# Altium schematic sheet 18-GSM_GPRS (SIM808).SchDoc
size A4
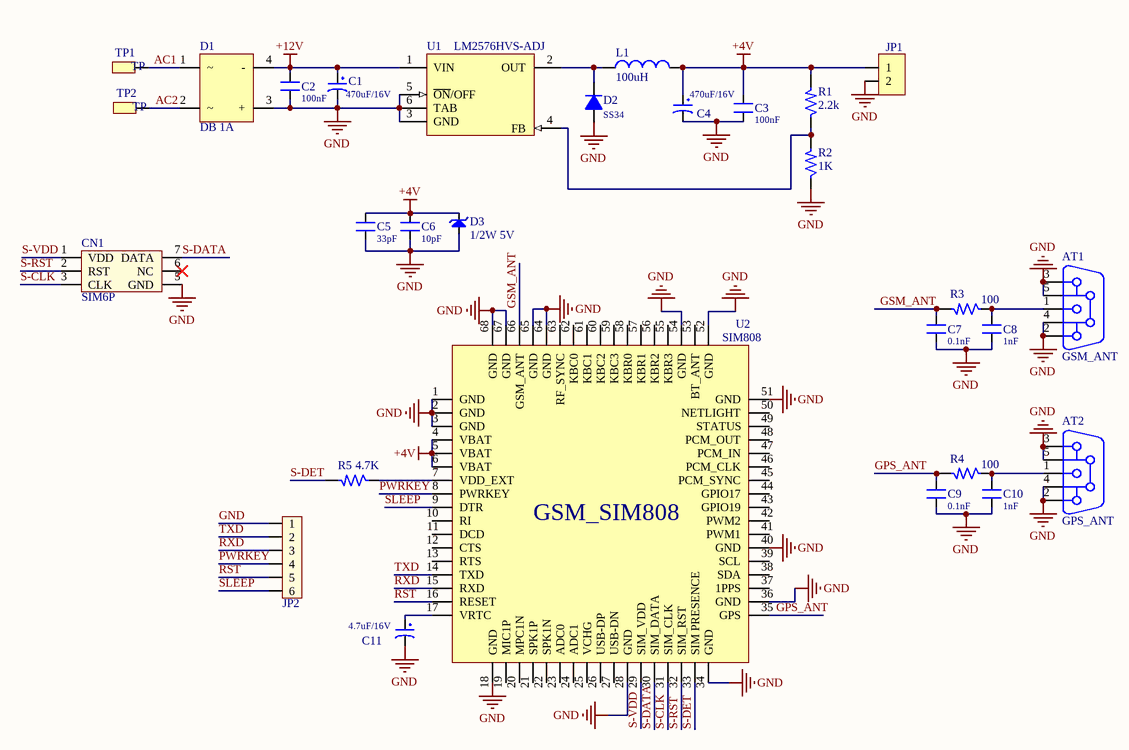
[diagram p0: 18-GSM_GPRS (SIM808).SchDoc]

## Parts
AT1  GSM_ANT  [SMA-RA]
AT2  GPS_ANT  [SMA-RA]
C1  470uF/16V  [C-TANT-7343]
C2  100nF  [CER-0805]
C3  100nF  [CER-0805]
C4  470uF/16V  [C-TANT-7343]
C5  33pF  [CER-0805]
C6  10pF  [CER-0805]
C7  0.1nF  [CER-0805]
C8  1nF  [CER-0805]
C9  0.1nF  [CER-0805]
C10  1nF  [CER-0805]
C11  4.7uF/16V  [C-TANT-7343]
CN1  SIM6P  [SK-SIM-C707A]
D1  DB 1A  [D-DB-1A-SMD]
D2  SS34  [DO-214AC]
D3  1/2W 5V  [DIO-SMD-106]
JP1  JP2  [JP2-C1T]  (value not drawn)
JP2  JP6 PIN  [JP6]  (value not drawn)
L1  value 100uH  [SMD-L-X10-Y10-Z4]  (hidden comment: Inductor)
R1  2.2k  [RES-0805]
R2  1K  [RES-0805]
R3  100  [RES-0805]
R4  100  [RES-0805]
R5  4.7K  [RES-0805]
TP1  1  [TP]  (value not drawn)
TP2  1  [TP]  (value not drawn)
U1  LM2576HVS-ADJ  [LM2576]
U2  SIM808  [GSM-SIM808]

## Nets
+4V: C3.2 C4.1 C5.2 C6.2 D3.2(K) JP1.1 L1.2 R1.2 U2.4(VBAT) U2.5(VBAT) U2.6(VBAT)
+12V: C1.1 C2.2 D1.4(-) U1.1(VIN)
GND: AT1.2 AT1.3 AT1.4 AT1.5 AT2.2 AT2.3 AT2.4 AT2.5 C1.2 C2.1 C3.1 C4.2 C5.1 C6.1 C7.1 C8.1 C9.1 C10.1 C11.2 CN1.5(GND) D1.3(+) D2.1(A) D3.1(A) JP1.2 JP2.1 R2.1 U1.3(GND) U1.5(~{ON}/OFF) U1.6(TAB) U2.1(GND) U2.2(GND) U2.3(GND) U2.18(GND) U2.28(GND) U2.34(GND) U2.36(GND) U2.40(GND) U2.51(GND) U2.52(GND) U2.54(GND) U2.64(GND) U2.65(GND) U2.67(GND) U2.68(GND)
AC1: D1.1 TP1.TP1
AC2: D1.2 TP2.TP1
GPS_ANT: C9.2 R4.2 U2.35(GPS)
GSM_ANT: C7.2 R3.2 U2.66(GSM_ANT)
PWRKEY: JP2.4 U2.8(PWRKEY)
RST: JP2.5 U2.16(RESET)
RXD: JP2.3 U2.15(RXD)
S-CLK: CN1.3(CLK) U2.31(SIM_CLK)
S-DATA: CN1.7(DATA) U2.30(SIM_DATA)
S-DET: R5.2 U2.33(SIM_PRESENCE)
S-RST: CN1.2(RST) U2.32(SIM_RST)
S-VDD: CN1.1(VDD) U2.29(SIM_VDD)
SLEEP: JP2.6 U2.9(DTR)
TXD: JP2.2 U2.14(TXD)
NetAT1_1: AT1.1 C8.2 R3.1
NetAT2_1: AT2.1 C10.2 R4.1
NetC11_1: C11.1 U2.17(VRTC)
NetD2_2: D2.2(K) L1.1 U1.2(OUT)
NetR1_1: R1.1 R2.2 U1.4(FB)
NetR5_1: R5.1 U2.7(VDD_EXT)

Not connected (* = marked no-connect by the designer): CN1 6(NC)*; U2 10(RI) 11(DCD) 12(CTS) 13(RTS) 19(MIC1P) 20(MPC1N) 21(SPK1P) 22(SPK1N) 23(ADC0) 24(ADC1) 25(VCHG) 26(USB-DP) 27(USB-DN) 37(1PPS) 38(SDA) 39(SCL) 41(PWM1) 42(PWM2) 43(GPIO19) 44(GPIO17) 45(PCM_SYNC) 46(PCM_CLK) 47(PCM_IN) 48(PCM_OUT) 49(STATUS) 50(NETLIGHT) 53(BT_ANT) 55(KBR3) 56(KBR2) 57(KBR1) 58(KBR0) 59(KBC3) 60(KBC2) 61(KBC1) 62(KBC0) 63(RF_SYNC)

## Notes on the sheet
- (in symbol GSM-Sim808) GSM_SIM808

## Library data of the parts
AT1 AT2 = CON Ant: CONNECTOR ANTEN; partNo: 210111003; Manufacturer: Würth Elektronik eiSos GmbH; ComponentLink1Description: Manufacturer; ComponentLink1URL: http://www.we-online.de; Created by: Christin Zierenner; Created Date: May 2012; ComponentLink2Description: Datasheet; ComponentLink2URL: http://katalog.we-online.de/kataloge/eisos/index.php?language=en&pf=Filter_gerade
C1 C4 C11 = Capacitor
C2 C3 C5-C10 = Ceramic
D1 = DB
D2 = Diode
D3 = DIODE Zener: Zenner
JP1 = JP2: WR-PHD 2.54 mm Angled Socket Header; Manufacturer: W¨¹rth Elektronik eiSos GmbH; partNo: 613002143121; ComponentLink1 Description: Manufacturer; ComponentLink2 Description: Datasheet; NoPins: 02; Created Date: 29 March 2013; ComponentLink1URL: http://www.we-online.com; ComponentLink2URL: http://katalog.we-online.de/em/datasheet/6130xx143121.pdf; Created by: Karrer Zheng
JP2 = JP6: Value: JP7
L1 = Inductor: Code_IEC: 1005; Published: 8-Jun-2000; LatestRevisionDate: 29-May-2009; LatestRevisionNote: IPC-7351 Footprint Added.; PackageReference: 0402-A; Publisher: Altium Limited; PackageDescription: Chip Inductor; Code_JEITA: 0402
R1-R5 = Res1/4W
TP1 TP2 = TP: CONNECT 1
U1 = LM2576HVS-5.0: SIMPLE SWITCHER; 3A Step-Down Voltage Regulator; Manufacturer: National Semiconductor; PackageTopMarking: NSUZXYTT*LM2576*HVS-5.0 P+; PowerWise: N; FirstPublished: 4-Dec-2008; DatasheetVersion: Aug-2004; PackageVersion: revD, Apr-2005; PackageReference: TS5B; Publisher: Altium Limited; PackageDescription: TO-263, Molded, .400 x .390 x .180in, 5 Lead, .067in Pitch, Surface Mount; CompType: Switcher; PartNumber: LM2576HVS-5.0; RoHS: O; PinCount: 5; DigiKeyPartNumber: LM2576HVS-5.0-ND; Code_JEDEC: MO-169-AB; ComponentLink1Description: LM2576HV Datasheet; ComponentLink1URL: http://www.national.com/ds/LM/LM2576HV.pdf; ComponentLink2Description: LM2576HV Web Page; ComponentLink2URL: http://www.national.com/pf/LM/LM2576HV.html; ComponentLink3Description: TS5B Package Page; ComponentLink3URL: http://www.national.com/packaging/folders/ts5b.html
U2 = GSM-Sim808
CN1 = SIM6P: Value: SIM6P